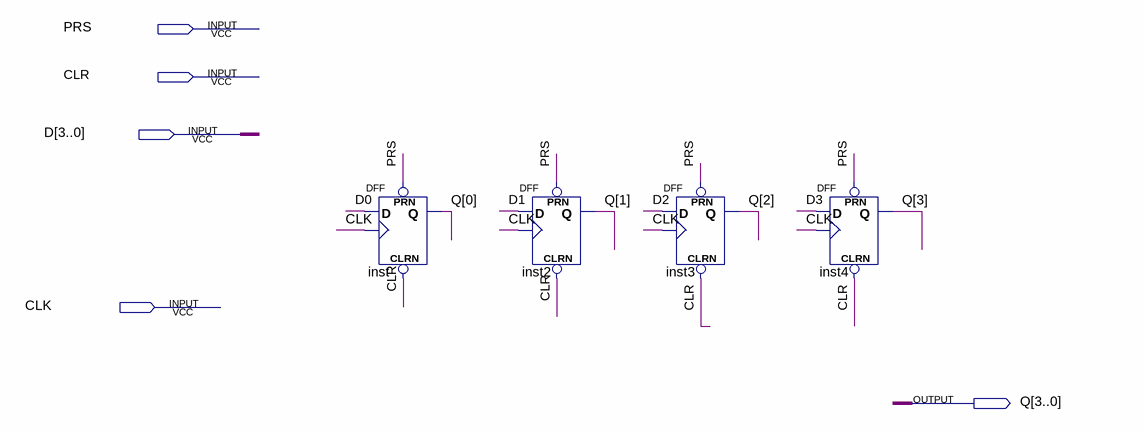
[diagram p0: schematic sheet]
// Quartus schematic regp.bdf as structural Verilog: 4 symbols, 5 pins
module regp (
  input  PRS,
  input  CLR,
  input  [3:0] D,
  input  CLK,
  output [3:0] Q
);

  DFF inst (.CLRN(CLR), .CLK(CLK), .D(D[0]), .PRN(PRS), .Q(Q[0]));
  DFF inst2 (.CLRN(CLR), .CLK(CLK), .D(D[1]), .PRN(PRS), .Q(Q[1]));
  DFF inst3 (.CLRN(CLR), .CLK(CLK), .D(D[2]), .PRN(PRS), .Q(Q[2]));
  DFF inst4 (.CLRN(CLR), .CLK(CLK), .D(D[3]), .PRN(PRS), .Q(Q[3]));
endmodule
